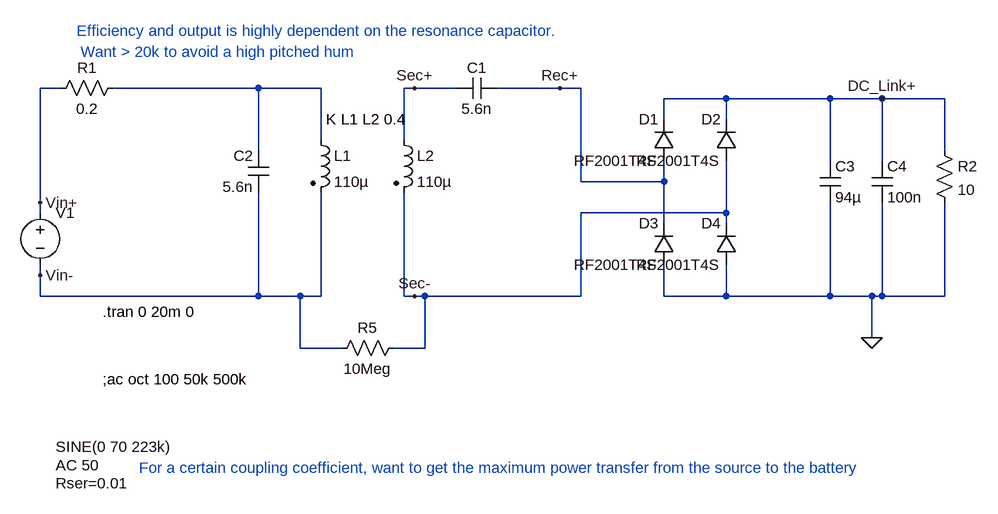
[diagram p0: schematic SP_rectifier_only.asc]
SP_rectifier_only.asc, the LTspice schematic file:
Version 4
SHEET 1 2420 752
WIRE -1216 112 -1248 112
WIRE -912 112 -1136 112
WIRE -816 112 -912 112
WIRE -672 112 -688 112
WIRE -608 112 -672 112
WIRE -448 112 -544 112
WIRE -416 112 -448 112
WIRE -192 128 -288 128
WIRE -32 128 -192 128
WIRE 48 128 -32 128
WIRE 144 128 48 128
WIRE -288 160 -288 128
WIRE -192 160 -192 128
WIRE -816 192 -816 112
WIRE -688 192 -688 112
WIRE -912 208 -912 112
WIRE 144 208 144 128
WIRE -32 224 -32 128
WIRE 48 224 48 128
WIRE -416 256 -416 112
WIRE -288 256 -288 224
WIRE -288 256 -416 256
WIRE -1248 288 -1248 112
WIRE -1248 304 -1248 288
WIRE -192 304 -192 224
WIRE -192 304 -416 304
WIRE -288 320 -288 256
WIRE -192 320 -192 304
WIRE -1248 400 -1248 384
WIRE -1248 432 -1248 400
WIRE -912 432 -912 272
WIRE -912 432 -1248 432
WIRE -848 432 -912 432
WIRE -816 432 -816 272
WIRE -816 432 -848 432
WIRE -688 432 -688 272
WIRE -672 432 -688 432
WIRE -656 432 -672 432
WIRE -416 432 -416 304
WIRE -416 432 -656 432
WIRE -288 432 -288 384
WIRE -192 432 -192 384
WIRE -192 432 -288 432
WIRE -32 432 -32 288
WIRE -32 432 -192 432
WIRE 32 432 -32 432
WIRE 48 432 48 288
WIRE 48 432 32 432
WIRE 144 432 144 288
WIRE 144 432 48 432
WIRE 32 496 32 432
WIRE -848 512 -848 432
WIRE -784 512 -848 512
WIRE -656 512 -656 432
WIRE -656 512 -704 512
FLAG 32 496 0
FLAG 48 128 DC_Link+
FLAG -1248 288 Vin+
FLAG -1248 400 Vin-
FLAG -672 112 Sec+
FLAG -672 432 Sec-
FLAG -448 112 Rec+
SYMBOL ind2 -832 176 R0
SYMATTR InstName L1
SYMATTR Value 110µ
SYMATTR Type ind
SYMATTR SpiceLine Rser=0.6
SYMBOL ind2 -704 176 R0
SYMATTR InstName L2
SYMATTR Value 110µ
SYMATTR Type ind
SYMATTR SpiceLine Rser=0.2
SYMBOL diode -272 384 R180
WINDOW 0 24 64 Left 2
WINDOW 3 24 0 Left 2
SYMATTR InstName D3
SYMATTR Value RF2001T4S
SYMBOL cap -48 224 R0
SYMATTR InstName C3
SYMATTR Value 94µ
SYMATTR SpiceLine V=100 Rser=0.01
SYMBOL cap 32 224 R0
SYMATTR InstName C4
SYMATTR Value 100n
SYMATTR SpiceLine V=100 Rser=0.1
SYMBOL diode -272 224 R180
WINDOW 0 24 64 Left 2
WINDOW 3 24 0 Left 2
SYMATTR InstName D1
SYMATTR Value RF2001T4S
SYMBOL diode -176 224 R180
WINDOW 0 24 64 Left 2
WINDOW 3 24 0 Left 2
SYMATTR InstName D2
SYMATTR Value RF2001T4S
SYMBOL diode -176 384 R180
WINDOW 0 24 64 Left 2
WINDOW 3 24 0 Left 2
SYMATTR InstName D4
SYMATTR Value RF2001T4S
SYMBOL res -688 496 R90
WINDOW 0 0 56 VBottom 2
WINDOW 3 32 56 VTop 2
SYMATTR InstName R5
SYMATTR Value 10Meg
SYMBOL voltage -1248 288 R0
WINDOW 3 24 376 Left 2
WINDOW 123 24 404 Left 2
WINDOW 39 24 432 Left 2
SYMATTR Value SINE(0 70 223k)
SYMATTR Value2 AC 50
SYMATTR SpiceLine Rser=0.01
SYMATTR InstName V1
SYMBOL res 128 192 R0
SYMATTR InstName R2
SYMATTR Value 10
SYMBOL cap -896 272 R180
WINDOW 0 24 56 Left 2
WINDOW 3 24 8 Left 2
SYMATTR InstName C2
SYMATTR Value 5.6n
SYMBOL res -1120 96 R90
WINDOW 0 0 56 VBottom 2
WINDOW 3 32 56 VTop 2
SYMATTR InstName R1
SYMATTR Value 0.2
SYMBOL cap -544 96 R90
WINDOW 0 0 32 VBottom 2
WINDOW 3 32 32 VTop 2
SYMATTR InstName C1
SYMATTR Value 5.6n
TEXT -808 160 Left 2 !K L1 L2 0.4
TEXT -1096 696 Left 2 ;For a certain coupling coefficient, want to get the maximum power transfer from the source to the battery
TEXT -760 56 Right 2 ;Want > 20k to avoid a high pitched hum
TEXT -1192 24 Left 2 ;Efficiency and output is highly dependent on the resonance capacitor.
TEXT -1152 456 Left 2 !.tran 0 20m 0
TEXT -1152 560 Left 2 !;ac oct 100 50k 500k

The netlist it stands for:
* SP_rectifier_only.asc
L1 N001 Vin- 110µ Rser=0.6
L2 Sec+ Sec- 110µ Rser=0.2
D3 0 Rec+ RF2001T4S
C3 DC_Link+ 0 94µ V=100 Rser=0.01
C4 DC_Link+ 0 100n V=100 Rser=0.1
D1 Rec+ DC_Link+ RF2001T4S
D2 Sec- DC_Link+ RF2001T4S
D4 0 Sec- RF2001T4S
R5 Sec- Vin- 10Meg
V1 Vin+ Vin- SINE(0 70 223k) AC 50 Rser=0.01
R2 DC_Link+ 0 10
C2 Vin- N001 5.6n
R1 N001 Vin+ 0.2
C1 Rec+ Sec+ 5.6n
.model D D
.lib standard.dio
K L1 L2 0.4
* For a certain coupling coefficient, want to get the maximum power transfer from the source to the battery
* Want > 20k to avoid a high pitched hum
* Efficiency and output is highly dependent on the resonance capacitor.
.tran 0 20m 0
;ac oct 100 50k 500k
.backanno
.end